# EAGLE design oshpark2.1.2-peripherals (EAGLE 6.6.0)
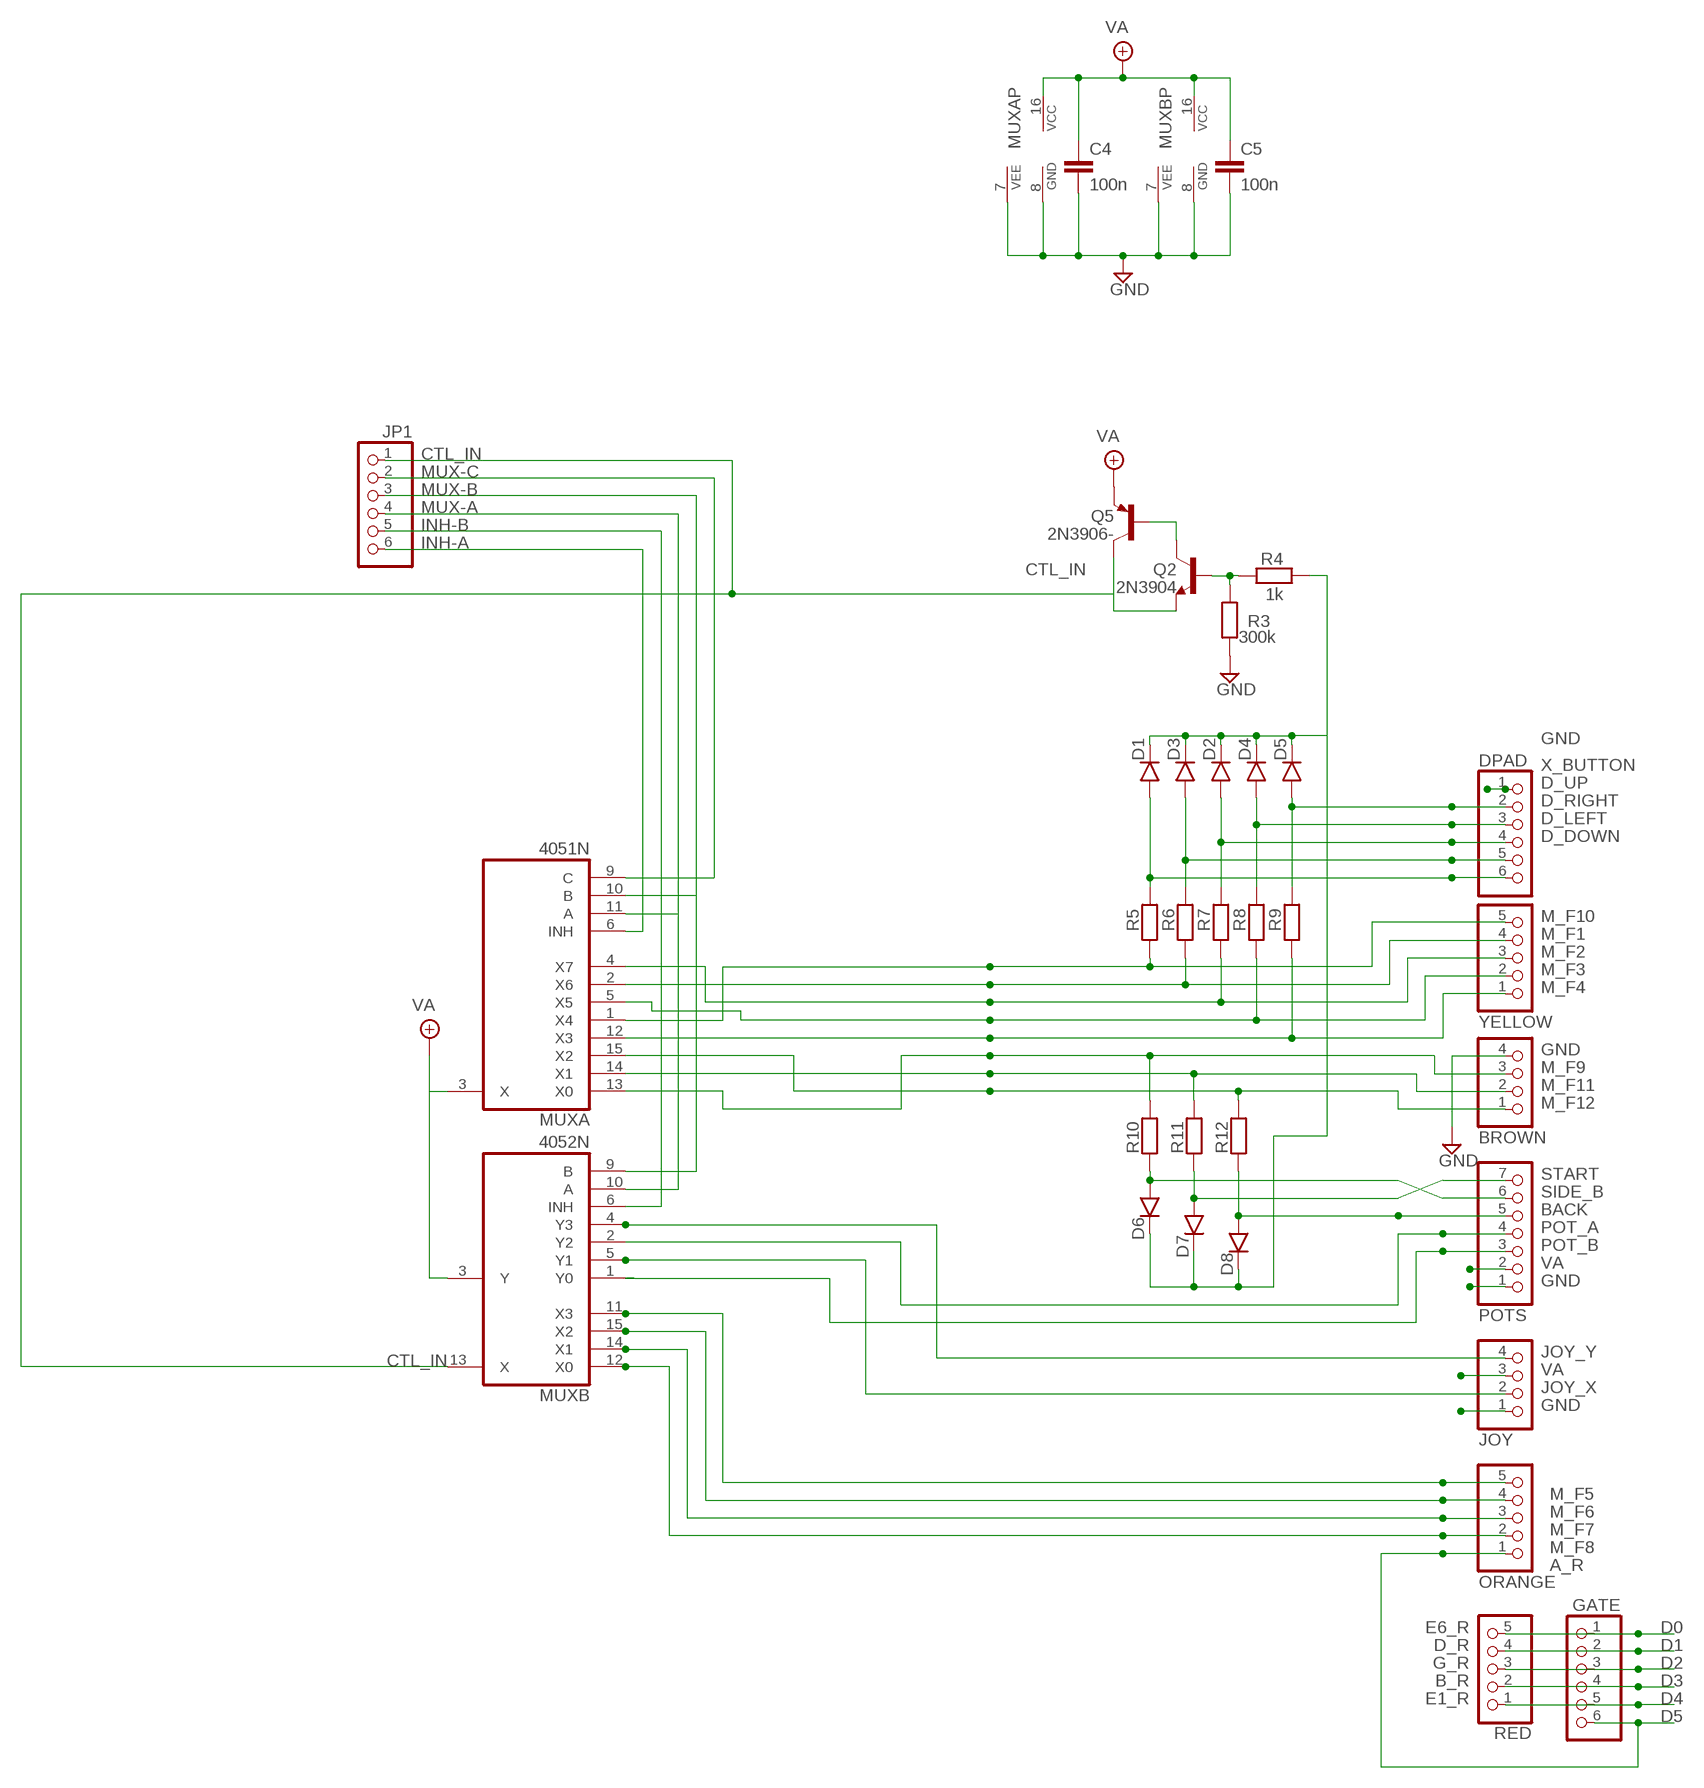
[diagram p0: schematic, sheet 1]

## Parts
BROWN  PINHD-1X4  [1X04]
C4  100n  050X030_0501  [050X030_050_1]
C5  100n  050X030_050  [050X030_050_3]
D1  1N4148-2  [DO35-2]
D2  1N4148-2  [DO35-2]
D3  1N4148-2  [DO35-2]
D4  1N4148-2  [DO35-2]
D5  1N4148-2  [DO35-2]
D6  1N4148-2  [DO35-2]
D7  1N4148-2  [DO35-2]
D8  1N4148-2  [DO35-2]
DPAD  PINHD-1X6  [1X06]
GATE  PINHD-1X6  [1X06]
JOY  PINHD-1X4  [1X04]
JP1  PINHD-1X6  [1X06]
MUXA  4051N  [DIL16]
MUXB  4052N  [DIL16]
ORANGE  PINHD-1X5  [1X05]
POTS  PINHD-1X7  [1X07]
Q2  2N3904  [TO92-]
Q5  2N3906-  [TO92-]
R3  300k  6MM-EU1  [R0207/1V]
R4  1k  6MM-EU  [R0207/3]
R5  30k  6MM-EU1  [R0207/1V]
R6  30k  6MM-EU1  [R0207/1V]
R7  30k  6MM-EU1  [R0207/1V]
R8  30k  6MM-EU1  [R0207/1V]
R9  30k  6MM-EU1  [R0207/1V]
R10  30k  6MM-EU2  [R0207/2V]
R11  30k  6MM-EU2  [R0207/2V]
R12  30k  6MM-EU2  [R0207/2V]
RED  PINHD-1X5  [1X05]
YELLOW  PINHD-1X5  [1X05]

## Nets
BACK: D7.A POTS.7 R11.2
CTL_IN: JP1.1 MUXB.13(X) Q2.3(E) Q5.1(C)
D0: GATE.1 RED.5
D1: GATE.2 RED.4
D2: GATE.3 RED.3
D3: GATE.4 RED.2
D4: GATE.5 RED.1
D5: GATE.6 ORANGE.1
D_DOWN: D1.A DPAD.6 R5.2
D_LEFT: D3.A DPAD.5 R6.2
D_RIGHT: D2.A DPAD.4 R7.2
D_UP: D4.A DPAD.3 R8.2
GND: BROWN.4 C4.2 C5.2 DPAD.1 JOY.1 MUXA.7(VEE) MUXA.8(GND) MUXB.7(VEE) MUXB.8(GND) POTS.1 R3.2
INH-A: JP1.6 MUXA.6(INH)
INH-B: JP1.5 MUXB.6(INH)
JOY_X: JOY.2 MUXB.5(Y1)
JOY_Y: JOY.4 MUXB.4(Y3)
M_F1: MUXA.2(X6) R6.1 YELLOW.4
M_F2: MUXA.4(X7) R7.1 YELLOW.3
M_F3: MUXA.5(X5) R8.1 YELLOW.2
M_F4: MUXA.12(X3) R9.1 YELLOW.1
M_F5: MUXB.11(X3) ORANGE.5
M_F6: MUXB.15(X2) ORANGE.4
M_F7: MUXB.14(X1) ORANGE.3
M_F8: MUXB.12(X0) ORANGE.2
M_F9: BROWN.3 MUXA.13(X0) R10.1
M_F10: MUXA.1(X4) R5.1 YELLOW.5
M_F11: BROWN.2 MUXA.14(X1) R11.1
M_F12: BROWN.1 MUXA.15(X2) R12.1
MUX-A: JP1.4 MUXA.11(A) MUXB.10(A)
MUX-B: JP1.3 MUXA.10(B) MUXB.9(B)
MUX-C: JP1.2 MUXA.9(C)
N$2: Q2.1(C) Q5.2(B)
N$5: Q2.2(B) R3.1 R4.2
N$19: D1.C D2.C D3.C D4.C D5.C D6.C D7.C D8.C R4.1
POT_A: MUXB.2(Y2) POTS.4
POT_B: MUXB.1(Y0) POTS.3
SIDE_B: D6.A POTS.6 R10.2
START: D8.A POTS.5 R12.2
VA: C4.1 C5.1 JOY.3 MUXA.3(X) MUXA.16(VCC) MUXB.3(Y) MUXB.16(VCC) POTS.2 Q5.3(E)
X_BUTTON: D5.A DPAD.2 R9.2

## Notes on the sheet
- A_R
- E6_R
- D_R
- G_R
- B_R
- E1_R

## Library data of the parts
BROWN JOY = pinhead:PINHD-1X4: PIN HEADER
C4 C5 = gm-caps-ceramic:050X030_050: 120 - 150pF Xicon Ceramic Disc 5mm lead spacing
D1-D8 = gm-diodes:1N4148: Fast Switching Diode DO-35 glass case a.k.a. 1N914
DPAD GATE JP1 = pinhead:PINHD-1X6: PIN HEADER
MUXA = 40xx:4051: 8-channel ANALOG MULTIPLEXER
MUXB = 40xx:4052: Dual 4-channel ANALOG MULTIPLEXER
ORANGE RED YELLOW = pinhead:PINHD-1X5: PIN HEADER
POTS = pinhead:PINHD-1X7: PIN HEADER
Q2 = gm-trans:2N3904: NPN Transistor
Q5 = gm-trans:2N3906: PNP Transistor
R3-R12 = gm-resistors:6MM-EU: 6mm Resistors (European schematic symbol) Leads spaced 1-6 holes apart for 0.1" perfboard. Suitable for 1/4 watt resistors.

## Board
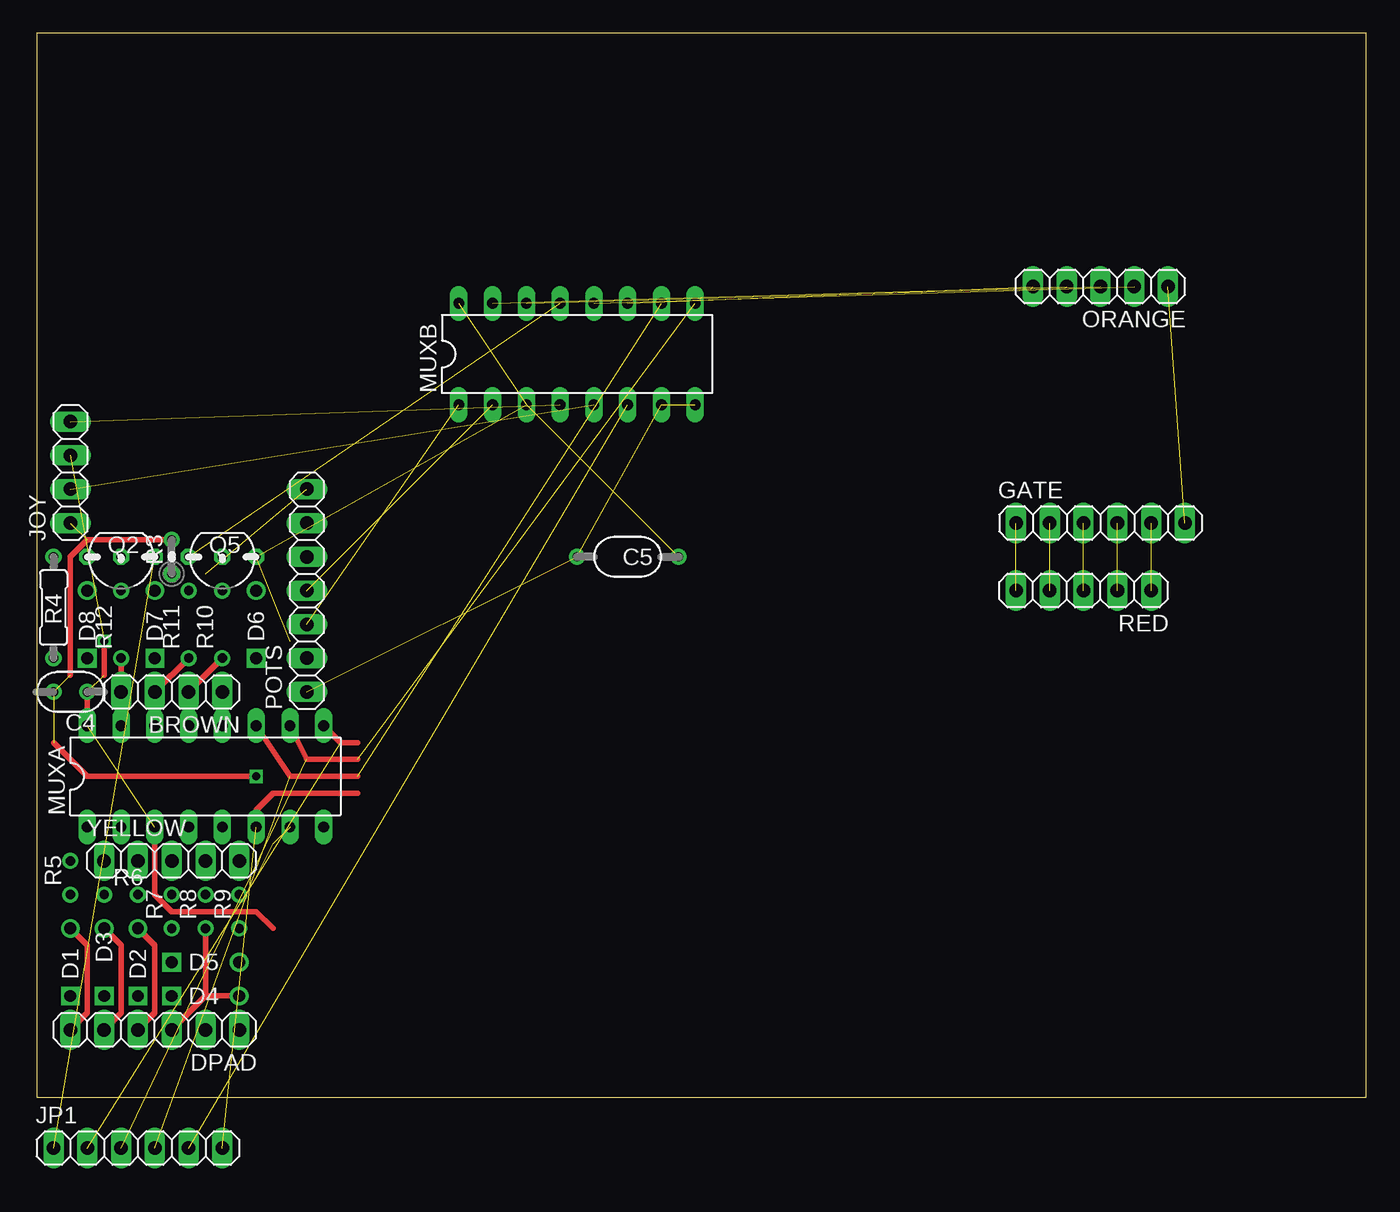
[diagram p1: board, top side]
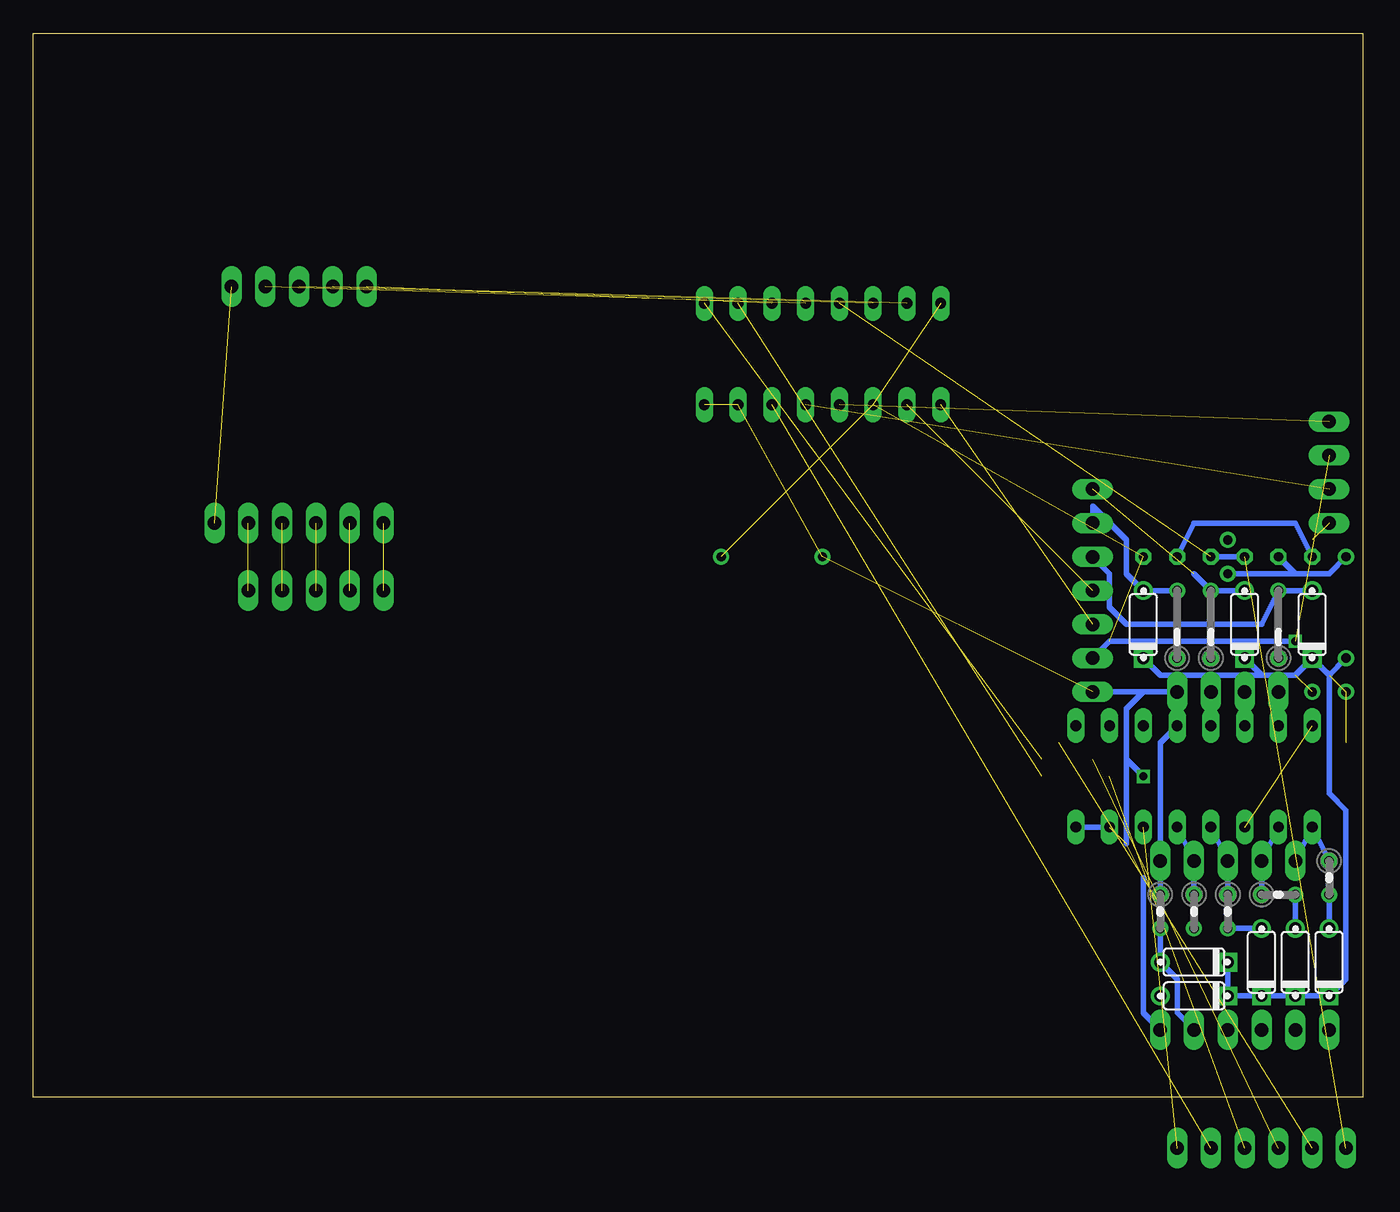
[diagram p2: board, bottom side, seen from below]

Size 100 x 80 mm. Coordinates in mm from the lower left corner, seen from the top.
Outline: 0,0 100,0 100,80 0,80 0,0
Copper layers (1*16): Top 0.035mm / dielectric 1.5mm / Bottom 0.035mm
Design rules "default": minimum track width 10mil, minimum drill 24mil, track to track 8mil, track to pad 8mil, pad to pad 8mil, via to via 8mil, smd to smd 8mil, copper to edge 40mil, drill to drill 8mil, minimum pad ring 10mil, minimum via ring 8mil, stop-mask expansion 4mil, vias tented up to drill 0mil, thermal gap 10mil

### Footprints (pad centres in the part's own frame; a part is rotated, then mirrored left to right if it is on the bottom)
1X04 = drill 1.016 long: 1 -3.81,0; 2 -1.27,0; 3 1.27,0; 4 3.81,0
050X030_050_1 = drill 0.7: 1 -1.27,0; 2 1.27,0
050X030_050_3 = drill 0.7: 1 -3.81,0; 2 3.81,0
DO35-2 = drill 0.9: A 2.54,0 | drill 0.9 square: C -2.54,0
1X06 = drill 1.016 long: 1 -6.35,0; 2 -3.81,0; 3 -1.27,0; 4 1.27,0; 5 3.81,0; 6 6.35,0
DIL16 = drill 0.813 long: 1 -8.89,-3.81; 2 -6.35,-3.81; 3 -3.81,-3.81; 4 -1.27,-3.81; 5 1.27,-3.81; 6 3.81,-3.81; 7 6.35,-3.81; 8 8.89,-3.81; 9 8.89,3.81; 10 6.35,3.81; 11 3.81,3.81; 12 1.27,3.81; 13 -1.27,3.81; 14 -3.81,3.81; 15 -6.35,3.81; 16 -8.89,3.81
1X05 = drill 1.016 long: 1 -5.08,0; 2 -2.54,0; 3 0,0; 4 2.54,0; 5 5.08,0
1X07 = drill 1.016 long: 1 -7.62,0; 2 -5.08,0; 3 -2.54,0; 4 0,0; 5 2.54,0; 6 5.08,0; 7 7.62,0
TO92- = drill 0.7 octagon: 1 2.54,0; 2 0,0; 3 -2.54,0
R0207/1V = drill 0.7: 1 -1.27,0; 2 1.27,0
R0207/3 = drill 0.7: 1 -3.81,0; 2 3.81,0
R0207/2V = drill 0.7: 1 -2.54,0; 2 2.54,0

### Placement (x,y rotation side)
BROWN  10.16,30.48 0 top
C4  2.54,30.48 180 top
C5  44.45,40.64 180 top
D1  2.54,10.16 90 bottom
D2  7.62,10.16 90 bottom
D3  5.08,10.16 90 bottom
D4  12.7,7.62 180 bottom
D5  12.7,10.16 180 bottom
D6  16.51,35.56 90 bottom
D7  8.89,35.56 90 bottom
D8  3.81,35.56 90 bottom
DPAD  8.89,5.08 180 top
GATE  80.01,43.18 0 top
JOY  2.54,46.99 90 top
JP1  7.62,-3.81 0 top  (outside the outline)
MUXA  12.7,24.13 0 top
MUXB  40.64,55.88 0 top
ORANGE  80.01,60.96 180 top
POTS  20.32,38.1 90 top
Q2  6.35,40.64 180 top
Q5  13.97,40.64 180 top
R3  10.16,40.64 90 top
R4  1.27,36.83 90 top
R5  2.54,16.51 270 bottom
R6  6.35,15.24 0 bottom
R7  10.16,13.97 270 bottom
R8  12.7,13.97 270 bottom
R9  15.24,13.97 270 bottom
R10  13.97,35.56 90 bottom
R11  11.43,35.56 90 bottom
R12  6.35,35.56 90 bottom
RED  78.74,38.1 180 top
YELLOW  10.16,17.78 180 top

### Tracks (layer width: path | path; a pad name or v marks a point on that pad's centre or on a via)
BACK  (1 unrouted)
  Bottom 0.406: D7.A R11.2 12.7,39.37
CTL_IN  (2 unrouted)
  Bottom 0.406: Q2.3 Q5.1
D0  (1 unrouted)
D1  (1 unrouted)
D2  (1 unrouted)
D3  (1 unrouted)
D4  (1 unrouted)
D5  (1 unrouted)
D_DOWN
  Top 0.406: D1.A 3.81,11.43 3.81,6.35 DPAD.6
  Bottom 0.406: R5.2 D1.A
D_LEFT
  Top 0.406: D3.A 6.35,11.43 6.35,6.35 DPAD.5
  Bottom 0.406: D3.A R6.2
D_RIGHT  (via drill 0.6)
  Top 0.406: D2.A 8.89,11.43 8.89,6.35 DPAD.4
  Bottom 0.406: R7.2 D2.A
  other vias: 7.62,12.7
D_UP
  Top 0.406: DPAD.3 12.7,7.62 | 12.7,7.62 R8.2 | D4.A 12.7,7.62
GND  (via drill 0.6)  (8 unrouted)
  Top 0.406: 1.27,26.67 3.81,24.13 v16.51,24.13 | R3.2 3.81,41.91 2.54,40.64 2.54,31.75
  Bottom 0.406: 17.78,19.05 17.78,25.4 | 17.78,25.4 17.78,29.21 16.51,30.48 | v16.51,24.13 17.78,25.4 | DPAD.1 16.51,6.35 16.51,16.51 | BROWN.4 16.51,30.48 | 16.51,30.48 POTS.1 | MUXA.8 MUXA.7
INH-A  (1 unrouted)
  Top 0.406: MUXA.6 16.51,21.59 17.78,22.86 24.13,22.86
INH-B  (1 unrouted)
JOY_X  (1 unrouted)
JOY_Y  (1 unrouted)
M_F1
  Bottom 0.406: R6.1 YELLOW.4 MUXA.2
M_F2
  Bottom 0.406: R7.1 YELLOW.3 MUXA.4
M_F3
  Bottom 0.406: R8.1 YELLOW.2 MUXA.5
M_F4
  Bottom 0.406: R9.1 YELLOW.1 15.24,26.67 MUXA.12
M_F5  (1 unrouted)
M_F6  (1 unrouted)
M_F7  (1 unrouted)
M_F8  (1 unrouted)
M_F9
  Top 0.406: MUXA.13 BROWN.3 R10.1
M_F10
  Bottom 0.406: YELLOW.5 MUXA.1 R5.1
M_F11
  Top 0.406: MUXA.14 BROWN.2 R11.1
M_F12
  Top 0.406: MUXA.15 BROWN.1 R12.1
MUX-A  (2 unrouted)
  Top 0.406: MUXA.11 19.05,24.13 24.13,24.13
MUX-B  (2 unrouted)
  Top 0.406: MUXA.10 20.32,25.4 24.13,25.4
MUX-C  (1 unrouted)
  Top 0.406: MUXA.9 22.86,26.67 24.13,26.67
N$2
  Bottom 0.406: Q2.1 5.08,43.18 12.7,43.18 Q5.2
N$5
  Bottom 0.406: R4.2 2.54,39.37 5.08,39.37 | Q2.2 5.08,39.37 | 5.08,39.37 R3.1
N$19
  Bottom 0.406: R4.1 2.54,31.75 | 2.54,31.75 2.54,22.86 1.27,21.59 1.27,8.89 D1.C | D4.C D2.C D3.C D1.C | D5.C D4.C | D4.C D1.C | 2.54,31.75 D8.C 5.08,31.75 7.62,31.75 | 7.62,31.75 15.24,31.75 D6.C | D7.C 7.62,31.75
POT_A  (1 unrouted)
POT_B  (1 unrouted)
SIDE_B
  Bottom 0.406: R10.2 D6.A 17.78,39.37 17.78,41.91 20.32,44.45 POTS.6
START
  Bottom 0.406: D8.A R12.2 7.62,35.56 17.78,35.56 19.05,36.83 19.05,39.37 POTS.5
VA  (via drill 0.6)  (7 unrouted)
  Top 0.406: MUXA.3 8.89,15.24 10.16,13.97 16.51,13.97 17.78,12.7 | 5.08,31.75 v5.08,34.29 | C4.1 MUXA.16
  Bottom 0.406: v5.08,34.29 19.05,34.29 POTS.2
X_BUTTON
  Bottom 0.406: R9.2 D5.A 13.97,8.89 13.97,6.35 DPAD.2